# Altium schematic sheet 5V_Power_Supply.SchDoc: STM32F446 CNC
size B; Author: AM; CompanyName: Expatria Technologies; DrawnBy: A.Marles; Engineer: AM; Organization: Expatria Technolgoies; DocumentNumber: 9; SheetNumber: 9; SheetTotal: 14
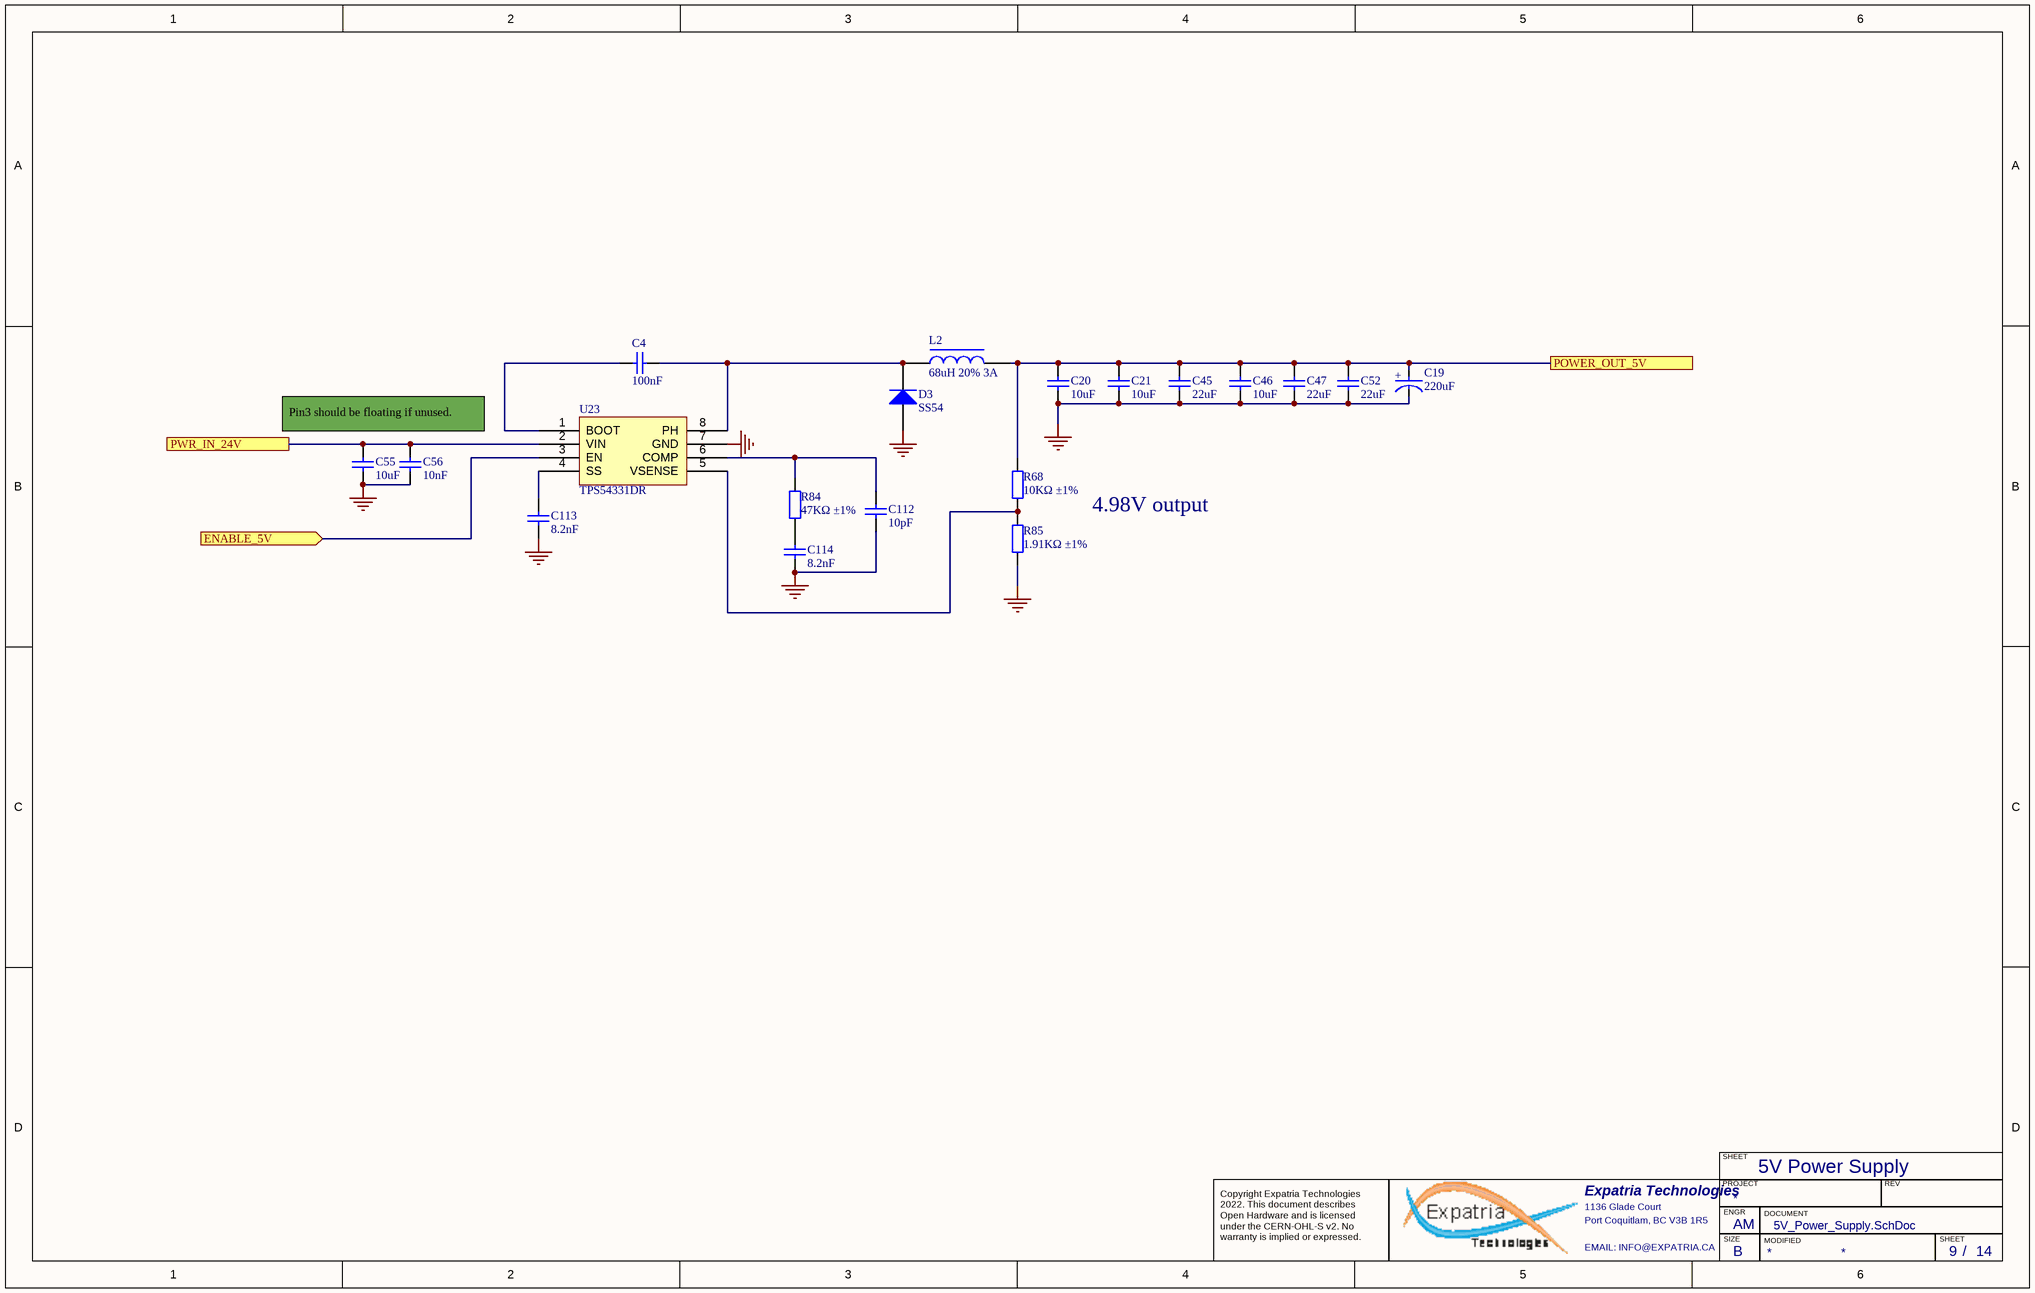
[diagram p0: 5V_Power_Supply.SchDoc]

## Parts
C4  100nF  [0603_C]
C19  Capacitance: 220uF  [FP-FKG-MFG]  (hidden comment: UUD1H221MNL1GS)
C20  10uF  [1206_C]
C21  10uF  [1206_C]
C45  22uF  [0805_C]
C46  10uF  [1206_C]
C47  22uF  [0805_C]
C52  22uF  [0805_C]
C55  10uF  [1206_C]
C56  10nF  [0603_C]
C112  10pF  [0603_C]
C113  8.2nF  [0603_C]
C114  8.2nF  [0603_C]
D3  SS54  [SMA(DO-214AC)_S1]
L2  68uH 20% 3A  [INDP126126X68N]
R68  10KΩ ±1%  [0603_R]
R84  47KΩ ±1%  [0603_R]
R85  1.91KΩ ±1%  [0603_R]
U23  TPS54331DR  [SOIC-8_150mil]

## Ports
ENABLE_5V (in), POWER_OUT_5V, PWR_IN_24V

## Nets
GND: C19.1(C) C20.1 C21.1 C45.1 C46.1 C47.1 C52.1 C55.1 C56.1 C112.1 C113.1 C114.1 D3.1(A) R85.1 U23.7(GND)
ENABLE_5V: U23.3(EN) ; port ENABLE_5V
POWER_OUT_5V: C19.2(A) C20.2 C21.2 C45.2 C46.2 C47.2 C52.2 L2.2 R68.2 ; port POWER_OUT_5V
PWR_IN_24V: C55.2 C56.2 U23.2(VIN) ; port PWR_IN_24V
NetC4_1: C4.1 U23.1(BOOT)
NetC4_2: C4.2 D3.2(K) L2.1 U23.8(PH)
NetC112_2: C112.2 R84.2 U23.6(COMP)
NetC113_2: C113.2 U23.4(SS)
NetC114_2: C114.2 R84.1
NetR68_1: R68.1 R85.2 U23.5(VSENSE)

## Notes on the sheet
- Pin3 should be floating if unused.
- 4.98V output
- 5V Power Supply
- SHEET
- Expatria Technologies
- 1136 Glade Court
- Port Coquitlam, BC V3B 1R5
- PROJECT
- SIZE
- ENGR
- MODIFIED
- DOCUMENT
- REV
- Copyright Expatria Technologies 2022. This document describes Open Hardware and is licensed under the CERN-OHL-S v2. No warranty is implied or expressed.
- EMAIL: INFO@EXPATRIA.CA
- B
- /
- (in symbol CMP-148-000001-1) +

## Library data of the parts
C4 = 0603 100nF (104) 10% 50V: 50V 100nF X7R ±10% 0603 Multilayer Ceramic Capacitors MLCC - SMD/SMT ROHS; Manufacturer: YAGEO; Manufacturer Part Number: CC0603KRX7R9BB104; Package: 0603; Supplier: LC; SuppliersPartNumber: C14663; Capacitance: 100nF; Tolerance: 10%; Voltage: 50V; ComponentLink1Description: Supplier link; ComponentLink1URL: http://www.szlcsc.com/product/details_15331.html
C19 = CMP-148-000001-1: CAP ALUM 220UF 20% 50V SMD; Manufacturer: Nichicon; Life: 2000Hours; Automotive Grade: Grade 2; Material: Aluminum; Dissipation Factor: 10%; Esr: 0.18Ω; ComponentLink1URL: https://industrial.panasonic.com/cdbs/www-data/pdf/RDE0000/ABA0000C1181.pdf; Tolerance: 20%; Lead Free: Yes; ComponentLink1Description: Datasheet; Digikey Description: CAP ALUM 220UF 20% 50V SMD; Source: Sienci_Labs.SchLib; Voltage Rating: 50V; Package: FKG; Value: 220uF; Design Item ID: UUD1H221MNL1GS; Automotive: Yes; Manufacturer Part Number: UUD1H221MNL1GS; Device Class L2: Capacitors; SuppliersPartNumber: C125976; Device Class L3: Aluminum Electrolytic Capacitors; Device Class L1: Passive Components; Temperature Range High: +105°C; Height: 10.5mm
C20 C21 C46 C55 = 1206 10uF (106) 10% 50V: 50V 10uF X5R ±10% 1206 Multilayer Ceramic Capacitors MLCC - SMD/SMT ROHS; Manufacturer: Samsung Electro-Mechanics; Manufacturer Part Number: CL31A106KBHNNNE; Package: 1206; Supplier: LC; SuppliersPartNumber: C13585; Capacitance: 10uF; Tolerance: 10%; Voltage: 50V
C45 C47 C52 = 0805 22uF (226) 20% 25V: 25V 22uF X5R ±20% 0805 Multilayer Ceramic Capacitors MLCC - SMD/SMT ROHS; Manufacturer: Samsung Electro-Mechanics; Manufacturer Part Number: CL21A226MAQNNNE; Package: 0805; Supplier: LC; SuppliersPartNumber: C45783; Capacitance: 22uF; Tolerance: 20%; Voltage: 25V; ComponentLink1Description: Supplier link; ComponentLink1URL: http://www.szlcsc.com/product/details_46786.html
C56 = 0603 10nF (103) 10% 50V: 50V 10nF X7R ±10% 0603 Multilayer Ceramic Capacitors MLCC - SMD/SMT ROHS; Manufacturer: Guangdong Fenghua Advanced Tech; Manufacturer Part Number: 0603B103K500NT; Package: 0603; Supplier: LC; SuppliersPartNumber: C57112; Capacitance: 10nF; Tolerance: 10%; Voltage: 50V; ComponentLink1Description: Supplier link; ComponentLink1URL: http://www.szlcsc.com/product/details_58143.html
C112 = 0603 10pF (100) 5% 50V: Chip capacitors; Manufacturer: Samsung Electro-Mechanics; Manufacturer Part Number: CL10C100JB8NNNC; Tolerance: 5%; Voltage: 50V; Package: 0603; Supplier: LCSC; SuppliersPartNumber: C1634; Capacitance: 10pF; ComponentLink1Description: Supplier link; ComponentLink1URL: http://www.szlcsc.com/product/details_1986.html
C113 C114 = 0603 8.2nF (822) 10% 50V: 50V 8.2nF X7R ±10% 0603 Multilayer Ceramic Capacitors MLCC - SMD/SMT ROHS; Manufacturer: YAGEO; Manufacturer Part Number 1: CC0603KRX7R9BB822; Package: 0603; Supplier: LC; SuppliersPartNumber: C113812; Capacitance: 8.2nF; Tolerance: 10%; Voltage: 50V; Manufacturer 1: YAGEO; Value: 8.2nF; Manufacturer Part Number: CC0603KRX7R9BB822
D3 = SMA(DO-214AC) SS54: 40V 5A 550mV@5A; Manufacturer 1: MDD; Package: SMA(DO-214AC); Supplier: LCSC; SuppliersPartNumber: C22452; Manufacturer Part Number 1: SS54; Manufacturer: MDD; Manufacturer Part Number: SS54
L2 = CMP-009-00243-2: 3A 68uH ±20% 64.8mΩ SMD Inductors (SMD) ROHS; Package: SMD,12.5x12.5mm; SuppliersPartNumber: C7431083; Design Item ID: 12.5x12.5x6.5 68uH 20% 3A; Source: IUD.SchLib
R68 = 0603 10K (1002) 1%: Chip resistor; Manufacturer: Uniroyal Elec; Manufacturer Part Number: 0603WAF1002T5E; Power: 1/10W; Package: 0603; Supplier: LC; SuppliersPartNumber: C25804; Resistance: 10KΩ; Tolerance: 1%; ComponentLink1Description: Supplier link; ComponentLink1URL: http://www.szlcsc.com/product/details_26547.html
R84 = 0603 47K (4702) 1%: Chip resistor; Manufacturer: Uniroyal Elec; Manufacturer Part Number: 0603WAF4702T5E; Power: 1/10W; Package: 0603; Supplier: LCSC; SuppliersPartNumber: C25819; Resistance: 47KΩ; Tolerance: 1%; ComponentLink1Description: Supplier link; ComponentLink1URL: http://www.szlcsc.com/product/details_26562.html
R85 = 0603 1.91K (2001) 1%: Chip resistor; Manufacturer: TyoHM; PartNumber: RMC06031.91K1%N; Power: 1/10W; Package: 0603; Supplier: LC; SuppliersPartNumber: C325662; Resistance: 1.91KΩ; Tolerance: 1%; ComponentLink1Description: Supplier link; ComponentLink1URL: http://www.szlcsc.com/product/details_23702.html
U23 = TPS54331DR_[C9865]: Switching Voltage Regulators 3A 28V In Step Down SWIFT DC/DC Cnvrtr; Manufacturer: Texas Instruments; Package: SOIC-8_150mil; Supplier: LCSC; SuppliersPartNumber: C9865; Manufacturer Part Number: TPS54331DR